# Altium schematic sheet Sheet2.SchDoc
size A4; SheetNumber: 2; SheetTotal: 3
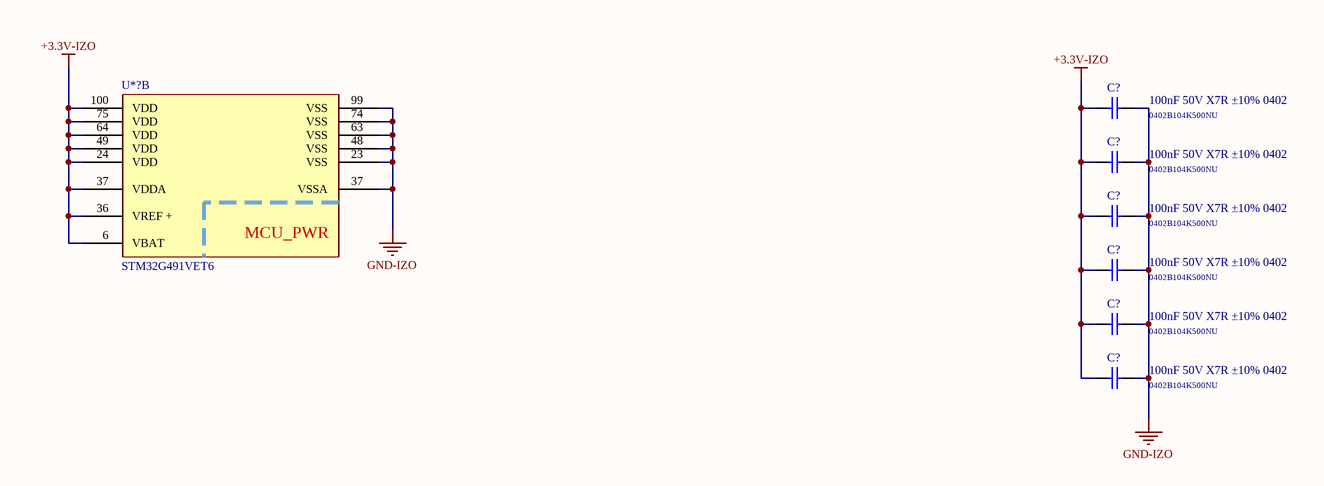
[diagram p0: Sheet2.SchDoc]

## Parts
(Parts that share a designator on the sheet are numbered #1, #2 ... from top to bottom, then left to right.)
C?#1  100nF 50V X7R ±10% 0402  Name: 0402B104K500NU  [0402]
C?#2  100nF 50V X7R ±10% 0402  Name: 0402B104K500NU  [0402]
C?#3  100nF 50V X7R ±10% 0402  Name: 0402B104K500NU  [0402]
C?#4  100nF 50V X7R ±10% 0402  Name: 0402B104K500NU  [0402]
C?#5  100nF 50V X7R ±10% 0402  Name: 0402B104K500NU  [0402]
C?#6  100nF 50V X7R ±10% 0402  Name: 0402B104K500NU  [0402]
U*?  STM32G491VET6  [QFP50P1600X1600X160-100N]  (part B of 2)

## Nets
+3.3V-IZO: C?#1.1 C?#2.1 C?#3.1 C?#4.1 C?#5.1 C?#6.1 U*?.6(VBAT) U*?.24(VDD) U*?.36(VREF_+) U*?.37(VDDA) U*?.49(VDD) U*?.64(VDD) U*?.75(VDD) U*?.100(VDD)
GND-IZO: C?#1.2 C?#2.2 C?#3.2 C?#4.2 C?#5.2 C?#6.2 U*?.23(VSS) U*?.37(VSSA) U*?.48(VSS) U*?.63(VSS) U*?.74(VSS) U*?.99(VSS)

## Notes on the sheet
- (in symbol STM32G491VET6, part B) MCU_PWR

## Library data of the parts
C?#1-C?#6 = Capacitor ceramic: Ceramic capacitor; Manufacturer: Hitano; Voltage: 50V; Tolerance: ±10%; Capacitance: 100nF; Dielectric: X7R; BOMString: =Capacitance+' '+Voltage+' '+Tolerance+' '+Footprint; HelpURL: *; Supplier: *